# Altium schematic sheet 5_USB-UART.SchDoc
size A4; SheetNumber: 8; SheetTotal: 12
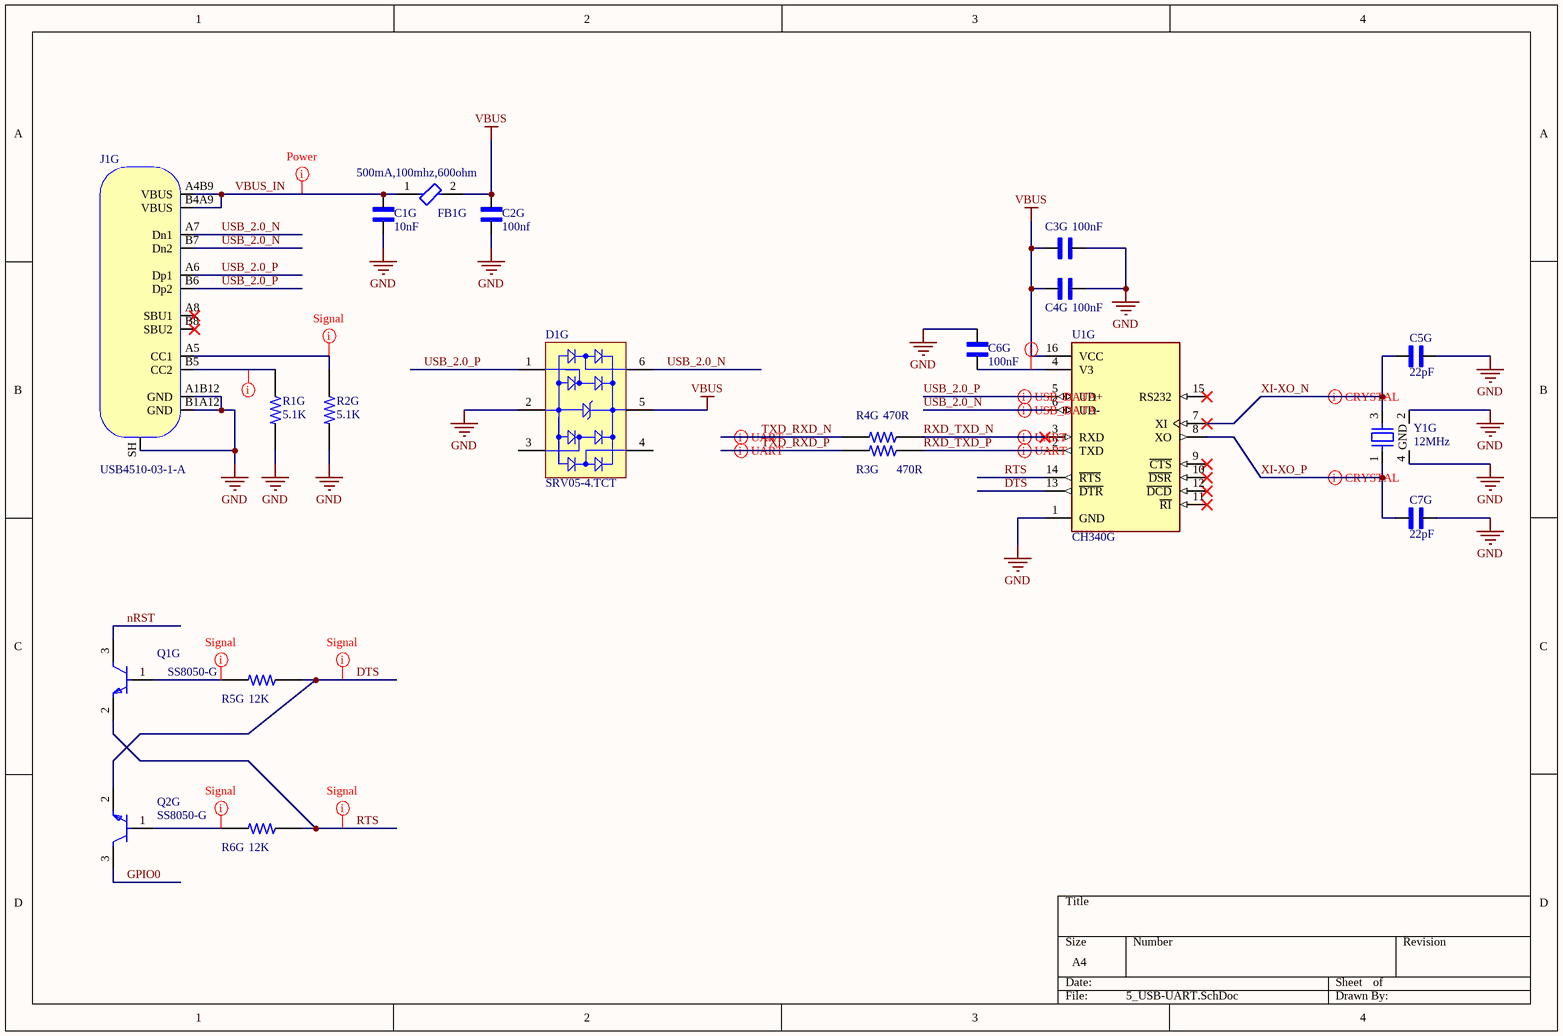
[diagram p0: 5_USB-UART.SchDoc]

## Parts
C1G  10nF  [C-0603]
C2G  100nf  [C-0603]
C3G  100nF  [C-0603]
C4G  100nF  [C-0603]
C5G  22pF  [C-0603]
C6G  100nF  [C-0603]
C7G  22pF  [C-0603]
D1G  SRV05-4.TCT  [SMTC-SOT23-6_V]
FB1G  500mA,100mhz,600ohm  [FP-BLM21-0_2-t0_85-e0_5-IPC_A]
J1G  USB4510-03-1-A  [USB4510-03-1-A]
Q1G  SS8050-G  [FP-SS8050-G-MFG]
Q2G  SS8050-G  [FP-SS8050-G-MFG]
R1G  5.1K  [R-0603]
R2G  5.1K  [R-0603]
R3G  470R  [R-0603]
R4G  470R  [R-0603]
R5G  12K  [R-0603]
R6G  12K  [R-0603]
U1G  CH340G  [SOIC127P600X180-16N]
Y1G  12MHz  [ABRACON ABM10]

## Nets
GND: C1G.1 C2G.1 C3G.1 C4G.1 C5G.2 C6G.1 C7G.2 D1G.2(GND) J1G.A1B12(GND) J1G.B1A12(GND) J1G.SH(SHIELD) R1G.2 R2G.2 U1G.1(GND) Y1G.2(GND) Y1G.4(GND)
VBUS: C2G.2 C3G.2 C4G.2 D1G.5(VBUS) FB1G.2 U1G.16(VCC)
DTS: Q2G.2(E) R5G.1 U1G.13(~{DTR})
GPIO0: Q2G.3(C)
nRST: Q1G.3(C)
RTS: Q1G.2(E) R6G.1 U1G.14(~{RTS})
RXD_TXD_N: R3G.1 U1G.3(RXD)
RXD_TXD_P: R4G.1 U1G.2(TXD)
TXD_RXD_N: R3G.2
TXD_RXD_P: R4G.2
USB_2.0_N: D1G.6(I/O_4) J1G.A7(Dn1) J1G.B7(Dn2) U1G.6(UD-)
USB_2.0_P: D1G.1(I/O_1) J1G.A6(Dp1) J1G.B6(Dp2) U1G.5(UD+)
VBUS_IN: C1G.2 FB1G.1 J1G.A4B9(VBUS) J1G.B4A9(VBUS)
XI-XO_N: C5G.1 U1G.7(XI) Y1G.3
XI-XO_P: C7G.1 U1G.8(XO) Y1G.1
NetC6G_2: C6G.2 U1G.4(V3)
NetJ1G_A5: J1G.A5(CC1) R2G.1
NetJ1G_B5: J1G.B5(CC2) R1G.1
NetQ1G_1: Q1G.1(B) R5G.2
NetQ2G_1: Q2G.1(B) R6G.2

Not connected (* = marked no-connect by the designer): D1G 3(I/O_2) 4(I/O_3); J1G A8(SBU1)* B8(SBU2)*; U1G 9(~{CTS})* 10(~{DSR})* 11(~{RI})* 12(~{DCD})* 15(RS232)*

## Layout directives
differential pair; differential pair class DIFF_PAIR; net class CRYSTAL: XI-XO_N, XI-XO_P
differential pair; differential pair class DIFF_PAIR; net class UART: RXD_TXD_N, RXD_TXD_P, TXD_RXD_N, TXD_RXD_P
differential pair; differential pair class DIFF_PAIR; net class USB_DATA: USB_2.0_N, USB_2.0_P
net class Power; rule Supply Nets [Voltage = 0.000]: VBUS_IN
net class Signal: DTS, NetC6G_2, NetJ1G_A5, NetJ1G_B5, NetQ1G_1, NetQ2G_1, RTS

## Library data of the parts
C1G C2G C3G C4G C5G C6G C7G = C-0603: Ceramic Capacitor 16V 0603 (1608 Metric); MP: C0603C104J4RAC; MF: KEMET; SnapEDA_Link: https://www.snapeda.com/parts/C0603C104J4RAC/KEMET/view-part/1763758/?ref=snap; Availability: Warning; Package: 0603 KEMET; Check_prices: https://www.snapeda.com/parts/C0603C104J4RAC/KEMET/view-part/1763758/?ref=eda; Value: *; Price: None
D1G = CMP-2000-05358-1: RailClamp(R) Low Capacitance TVS Diode Array, 5 pF, 17.5 VC, -55 to 125 degC, 6-Pin SOT23, RoHS, Tape and Reel; Manufacturer: Semtech; Leakage Current (Max): 5uA; Polarity: Uni-Directional; Peak Pulse Power Dissipation: 300W; Clamping Voltage: 17.5V; Number of Elements: 1; Working Voltage: 5V; Test Current (It): 1mA; Configuration: Quad; Reverse Breakdown Voltage: 6V; Suppressor Type: DiodeArrays; Peak Pulse Current: 12A; Product Depth (mm): 1.6mm; Product Height (mm): 1.15mm; Clamping Voltage (Max): 12.5V; Rad Hardened: No; Product Length (mm): 2.9mm; Capacitance Value: 5pF; Mounting: SurfaceMount; Datasheet URL: https://datasheet.ciiva.com/8029/srv05-4-8029973.pdf; Datasheet Version: Jan-08; Packaging: TapeandReel; Package / Case: SOT-23; Operating Temp Range: -55Cto125C; Pin Count: 6; Direction Type: Uni-Directional; Operating Temperature Min Deg. C: -55C; Reverse Stand-off Voltage: 5V; Leakage Current: 5uA; Manufacturer URL: http://www.semtech.com/; Working Voltage (Max): 5V; Package Reference: SOT23-6; Package Description: 6-Pin Small Outline Transistor, Body 2.9 x 1.6 mm, Pitch 0.95 mm; Operating Temperature Max Deg. C: 125C; Operating Temperature Classification: Military; Mounting Style: SurfaceMount
FB1G = CMP-0686-00646-3: BLM21BB121SN1D; Shielding: Unshielded; Number of Circuits: 1; DC Resistance-Max: 250mR; Material: Ferrite; Tolerance: 25%; DC Resistance (DCR): 190mR; Max Current Rating: 600mA; Impedance: 120R; Max DC Current: 200mA; Case Code (Imperial): 0805; RoHS Compliant: Yes; Frequency: 100MHz; Lead Free: Lead Free; Max Operating Temperature: 125°C; Min Operating Temperature: -55°C; Length: 2mm; Packaging: Tape and Reel; Case Code (Metric): 2012; Package Quantity: 1; Depth: 1.45mm; Test Frequency: 100MHz; Width: 1.25mm; Contact Plating: Tin; Height: 0.85mm; Number of Pins: 2; Case/Package: 0805; Termination: SMD/SMT; REACH SVHC: No SVHC; Current Rating: 600mA; Weight: 0.000194oz; Core Material: Ferrite; Series: BLM21B; Number of Lines: 1
J1G = USB4510-03-1-A: USB Connector Type C SMT Mid-Mount 16 Pin; Manufacturer: GCT; Manufacturer Part Number: USB4510-03-1-A
Q1G Q2G = CMP-20235-000001-1: NPN TRANSISTOR 1.5A 40V SOT-23 R; Transition Frequency: 100MHz; Max Breakdown Voltage: 25V; Collector Emitter Voltage (VCEO): 400mV; Max Power Dissipation: 300mW; Max Collector Current: 1.5A; Case/Package: TO-236-3; Packaging: Tape and Reel; RoHS Compliant: Yes; Mount: Surface Mount; Collector Emitter Breakdown Voltage: 25V
R1G R2G R3G R4G R5G R6G = R-0603: 0603; MP: 2-1623703-0; Power_Rating: .1 W; Value: 10K; Tolerance: 1%; MF: TE Connectivity; Package: 0603; Price: None; Resistance: 10K; Check_prices: https://www.snapeda.com/parts/2-1623703-0/TE%20Connectivity/view-part/2213192/?ref=eda; SnapEDA_Link: https://www.snapeda.com/parts/2-1623703-0/TE%20Connectivity/view-part/2213192/?ref=snap; Availability: Warning
Y1G = ABM10-167-12.000MHZ-T3: CRYSTAL 12.00MHZ 8PF LOW ESR SMD; Manufacturer: Abracon LLC; ESR (Equivalent Series Resistance): 125 Ohms; Frequency Stability: ±30ppm; Frequency Tolerance: ±10ppm; Operating Mode: Fundamental; Part Number: ABM10-167-12.000MHZ-T3; ComponentLink1Description: Datasheet; ComponentLink1URL: https://abracon.com/Resonators/ABM10-167-12.000MHz.pdf; ComponentLink2Description: DigiKey Link; ComponentLink2URL: http://digikey.com/product-detail/en/abracon-llc/ABM10-167-12.000MHZ-T3/535-13521-1-ND/6140274; Device Package: 4-SMD, No Lead; Frequency: 12MHz; Height - Seated (Max): 0.028" (0.70mm); LastUpdated: 19-03-2020 10:27:46 PM; Lifecycle Status: Active; Load Capacitance: 8pF; Minimum Order: 1; Mounting Type: Surface Mount; Operating Temperature: -40°C ~ 85°C; Package / Case: 4-SMD, No Lead; Packaging: TapeAndReel; PartId: 284; Part Status: Active; Price: 0.28; Series: ABM10; Size / Dimension: 0.098" L x 0.079" W (2.50mm x 2.00mm); Supplier 1: DigiKey; Supplier Part Number 1: 535-13521-1-ND; Type: MHz Crystal; Value: 12MHz
U1G = CH340G: Value: *; MP: CH340G; Package: None; Availability: Unavailable; Price: None